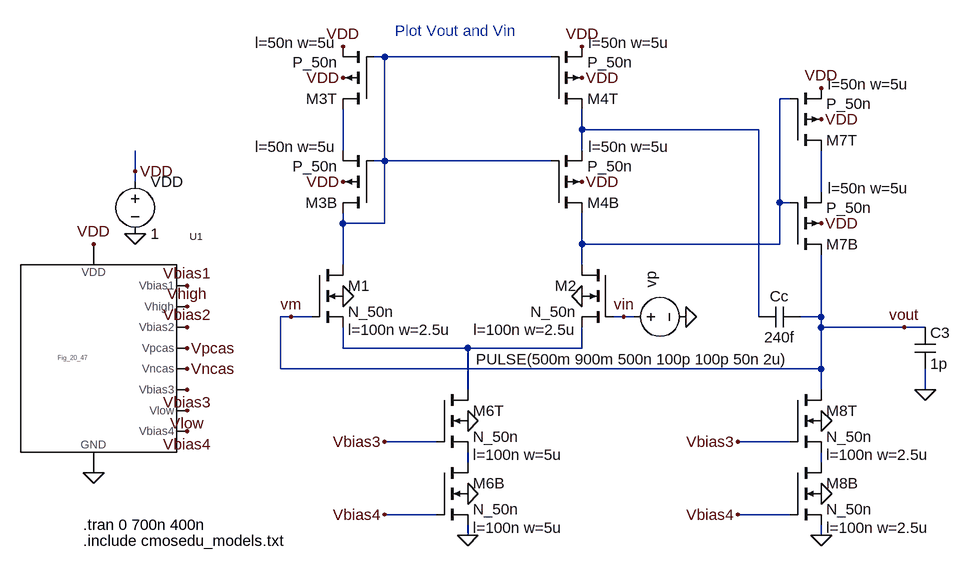
[diagram p0: schematic Fig24_24.asc]
Fig24_24.asc, the LTspice schematic file:
Version 4
SHEET 1 2144 680
WIRE 1248 -528 1232 -528
WIRE 1504 -528 1248 -528
WIRE 1872 -464 1856 -464
WIRE 1552 -416 1552 -448
WIRE 1824 -416 1552 -416
WIRE 1184 -384 1184 -448
WIRE 1552 -384 1552 -416
WIRE 1248 -368 1248 -528
WIRE 1248 -368 1232 -368
WIRE 1504 -368 1248 -368
WIRE 864 -352 864 -384
WIRE 864 -336 864 -352
WIRE 1920 -320 1920 -384
WIRE 1856 -304 1856 -464
WIRE 1872 -304 1856 -304
WIRE 1184 -272 1184 -288
WIRE 1248 -272 1248 -368
WIRE 1248 -272 1184 -272
WIRE 1552 -240 1552 -288
WIRE 1856 -240 1856 -304
WIRE 1856 -240 1552 -240
WIRE 1184 -208 1184 -272
WIRE 1552 -208 1552 -240
WIRE 1104 -128 1088 -128
WIRE 1136 -128 1104 -128
WIRE 1616 -128 1600 -128
WIRE 1632 -128 1616 -128
WIRE 1824 -128 1824 -416
WIRE 1920 -128 1920 -224
WIRE 1920 -128 1888 -128
WIRE 1920 -112 1920 -128
WIRE 2048 -112 1920 -112
WIRE 2080 -112 2048 -112
WIRE 1184 -80 1184 -112
WIRE 1376 -80 1184 -80
WIRE 1552 -80 1552 -112
WIRE 1552 -80 1376 -80
WIRE 1088 -48 1088 -128
WIRE 1920 -48 1920 -112
WIRE 1920 -48 1088 -48
WIRE 1376 -16 1376 -80
WIRE 1920 -16 1920 -48
WIRE 2080 -16 2080 -48
WIRE 1328 64 1248 64
WIRE 1872 64 1792 64
WIRE 1376 96 1376 80
WIRE 1920 96 1920 80
WIRE 1328 176 1248 176
WIRE 1872 176 1792 176
WIRE 1376 208 1376 192
WIRE 1920 208 1920 192
FLAG 864 -256 0
FLAG 864 -352 VDD
FLAG 1552 -160 0
FLAG 1376 208 0
FLAG 1184 -160 0
FLAG 1552 -544 VDD
FLAG 1552 -496 VDD
FLAG 1184 -496 VDD
FLAG 800 -240 VDD
FLAG 800 112 0
FLAG 944 -176 Vbias1
FLAG 944 -144 Vhigh
FLAG 944 -112 Vbias2
FLAG 944 -16 Vbias3
FLAG 944 -80 Vpcas
FLAG 944 -48 Vncas
FLAG 944 48 Vbias4
FLAG 944 16 Vlow
FLAG 1184 -544 VDD
FLAG 1376 32 0
FLAG 1376 144 0
FLAG 1248 64 Vbias3
FLAG 1248 176 Vbias4
FLAG 1712 -128 0
FLAG 1104 -128 vm
FLAG 1616 -128 vin
FLAG 1920 -272 VDD
FLAG 1920 208 0
FLAG 1920 32 0
FLAG 1920 144 0
FLAG 1792 64 Vbias3
FLAG 1792 176 Vbias4
FLAG 2048 -112 vout
FLAG 2080 -16 0
FLAG 1552 -336 VDD
FLAG 1184 -336 VDD
FLAG 1920 -480 VDD
FLAG 1920 -432 VDD
SYMBOL voltage 864 -352 R0
WINDOW 123 0 0 Left 2
WINDOW 39 0 0 Left 2
SYMATTR InstName VDD
SYMATTR Value 1
SYMBOL nmos4 1600 -208 M0
WINDOW 123 56 100 Left 2
SYMATTR Value2 l=100n w=2.5u
SYMATTR InstName M2
SYMATTR Value N_50n
SYMBOL nmos4 1136 -208 R0
WINDOW 123 56 100 Left 2
SYMATTR Value2 l=100n w=2.5u
SYMATTR InstName M1
SYMATTR Value N_50n
SYMBOL pmos4 1504 -448 M180
WINDOW 123 58 102 Left 2
WINDOW 0 56 16 Left 2
SYMATTR Value2 l=50n w=5u
SYMATTR InstName M4T
SYMATTR Value P_50n
SYMBOL pmos4 1232 -448 R180
WINDOW 123 58 102 Left 2
WINDOW 0 56 16 Left 2
SYMATTR Value2 l=50n w=5u
SYMATTR InstName M3T
SYMATTR Value P_50n
SYMBOL Fig_20_47 800 -64 R0
SYMATTR InstName U1
SYMBOL nmos4 1328 -16 R0
WINDOW 123 56 100 Left 2
SYMATTR Value2 l=100n w=5u
SYMATTR InstName M6T
SYMATTR Value N_50n
SYMBOL nmos4 1328 96 R0
WINDOW 123 56 100 Left 2
SYMATTR Value2 l=100n w=5u
SYMATTR InstName M6B
SYMATTR Value N_50n
SYMBOL voltage 1616 -128 R270
WINDOW 0 45 42 Left 2
WINDOW 3 -65 -227 VRight 2
WINDOW 39 0 0 Left 2
SYMATTR InstName vp
SYMATTR Value PULSE(500m 900m 500n 100p 100p 50n 2u)
SYMATTR Value2 AC 0
SYMBOL pmos4 1872 -224 M180
WINDOW 123 58 102 Left 2
WINDOW 0 56 16 Left 2
SYMATTR Value2 l=50n w=5u
SYMATTR InstName M7B
SYMATTR Value P_50n
SYMBOL nmos4 1872 -16 R0
WINDOW 123 56 100 Left 2
SYMATTR Value2 l=100n w=2.5u
SYMATTR InstName M8T
SYMATTR Value N_50n
SYMBOL nmos4 1872 96 R0
WINDOW 123 56 100 Left 2
SYMATTR Value2 l=100n w=2.5u
SYMATTR InstName M8B
SYMATTR Value N_50n
SYMBOL cap 1888 -144 R90
WINDOW 0 0 32 VBottom 2
WINDOW 3 32 32 VTop 2
SYMATTR InstName Cc
SYMATTR Value 240f
SYMBOL cap 2064 -112 R0
SYMATTR InstName C3
SYMATTR Value 1p
SYMBOL pmos4 1504 -288 M180
WINDOW 123 58 102 Left 2
WINDOW 0 56 16 Left 2
SYMATTR Value2 l=50n w=5u
SYMATTR InstName M4B
SYMATTR Value P_50n
SYMBOL pmos4 1232 -288 R180
WINDOW 123 58 102 Left 2
WINDOW 0 56 16 Left 2
SYMATTR Value2 l=50n w=5u
SYMATTR InstName M3B
SYMATTR Value P_50n
SYMBOL pmos4 1872 -384 M180
WINDOW 123 58 102 Left 2
WINDOW 0 56 16 Left 2
SYMATTR Value2 l=50n w=5u
SYMATTR InstName M7T
SYMATTR Value P_50n
TEXT 784 216 Left 2 !.include cmosedu_models.txt
TEXT 1264 -568 Left 2 ;Plot Vout and Vin
TEXT 784 192 Left 2 !.tran 0 700n 400n

The netlist it stands for:
* Fig24_24.asc
VDD VDD 0 1
M2 N002 vin N006 0 N_50n l=100n w=2.5u
M1 N001 vout N006 0 N_50n l=100n w=2.5u
M4T N003 N001 VDD VDD P_50n l=50n w=5u
M3T N004 N001 VDD VDD P_50n l=50n w=5u
XU1 Vbias1 Vhigh Vbias2 Vpcas Vncas Vbias3 Vlow Vbias4 VDD 0 Fig_20_47  ; pins Vbias1 Vhigh Vbias2 Vpcas Vncas Vbias3 Vlow Vbias4 VDD GND
M6T N006 Vbias3 N007 0 N_50n l=100n w=5u
M6B N007 Vbias4 0 0 N_50n l=100n w=5u
vp vin 0 PULSE(500m 900m 500n 100p 100p 50n 2u) AC 0
M7B vout N002 N005 VDD P_50n l=50n w=5u
M8T vout Vbias3 N008 0 N_50n l=100n w=2.5u
M8B N008 Vbias4 0 0 N_50n l=100n w=2.5u
Cc vout N003 240f
C3 vout 0 1p
M4B N002 N001 N003 VDD P_50n l=50n w=5u
M3B N001 N001 N004 VDD P_50n l=50n w=5u
M7T N005 N002 VDD VDD P_50n l=50n w=5u
.model NMOS NMOS
.model PMOS PMOS
.lib standard.mos
.include cmosedu_models.txt
* Plot Vout and Vin
.tran 0 700n 400n
.backanno
.end